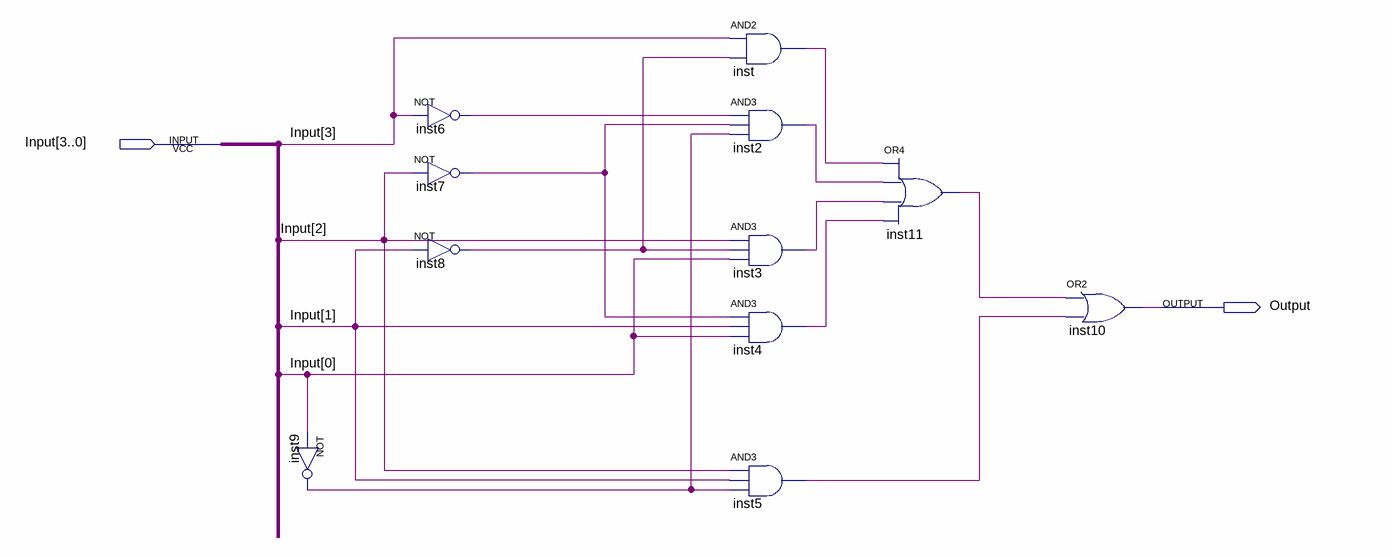
[diagram p0: schematic sheet]
// Quartus schematic display_d.bdf as structural Verilog: 11 symbols, 2 pins
module display_d (
  input  [3:0] Input,
  output Output
);

  wire inst2_out, inst3_out, inst4_out, inst5_out, inst6_out, inst7_out, inst8_out, inst9_out, inst11_out,
       inst_out;

  not inst9 (inst9_out, Input[0]);
  not inst6 (inst6_out, Input[3]);
  not inst7 (inst7_out, Input[2]);
  not inst8 (inst8_out, Input[1]);
  and inst (inst_out, Input[3], inst8_out);
  and inst2 (inst2_out, inst6_out, inst7_out, inst9_out);
  and inst3 (inst3_out, Input[2], inst8_out, Input[0]);
  and inst4 (inst4_out, inst7_out, Input[1], Input[0]);
  and inst5 (inst5_out, Input[2], Input[1], inst9_out);
  or inst11 (inst11_out, inst_out, inst2_out, inst3_out, inst4_out);
  or inst10 (Output, inst11_out, inst5_out);
endmodule
